# Altium schematic sheet Voltage_Measurement.SchDoc
size A4; CompanyName: Technische Hochschule Nürnberg Georg Simon Ohm; Organization: UltraZohm; Address1: Kesslerplatz 12; Address2: 90489 Nürnberg; Address3: GERMANY; DocumentNumber: 3; SheetNumber: 3; SheetTotal: 3; Website: www.ultrazohm.com
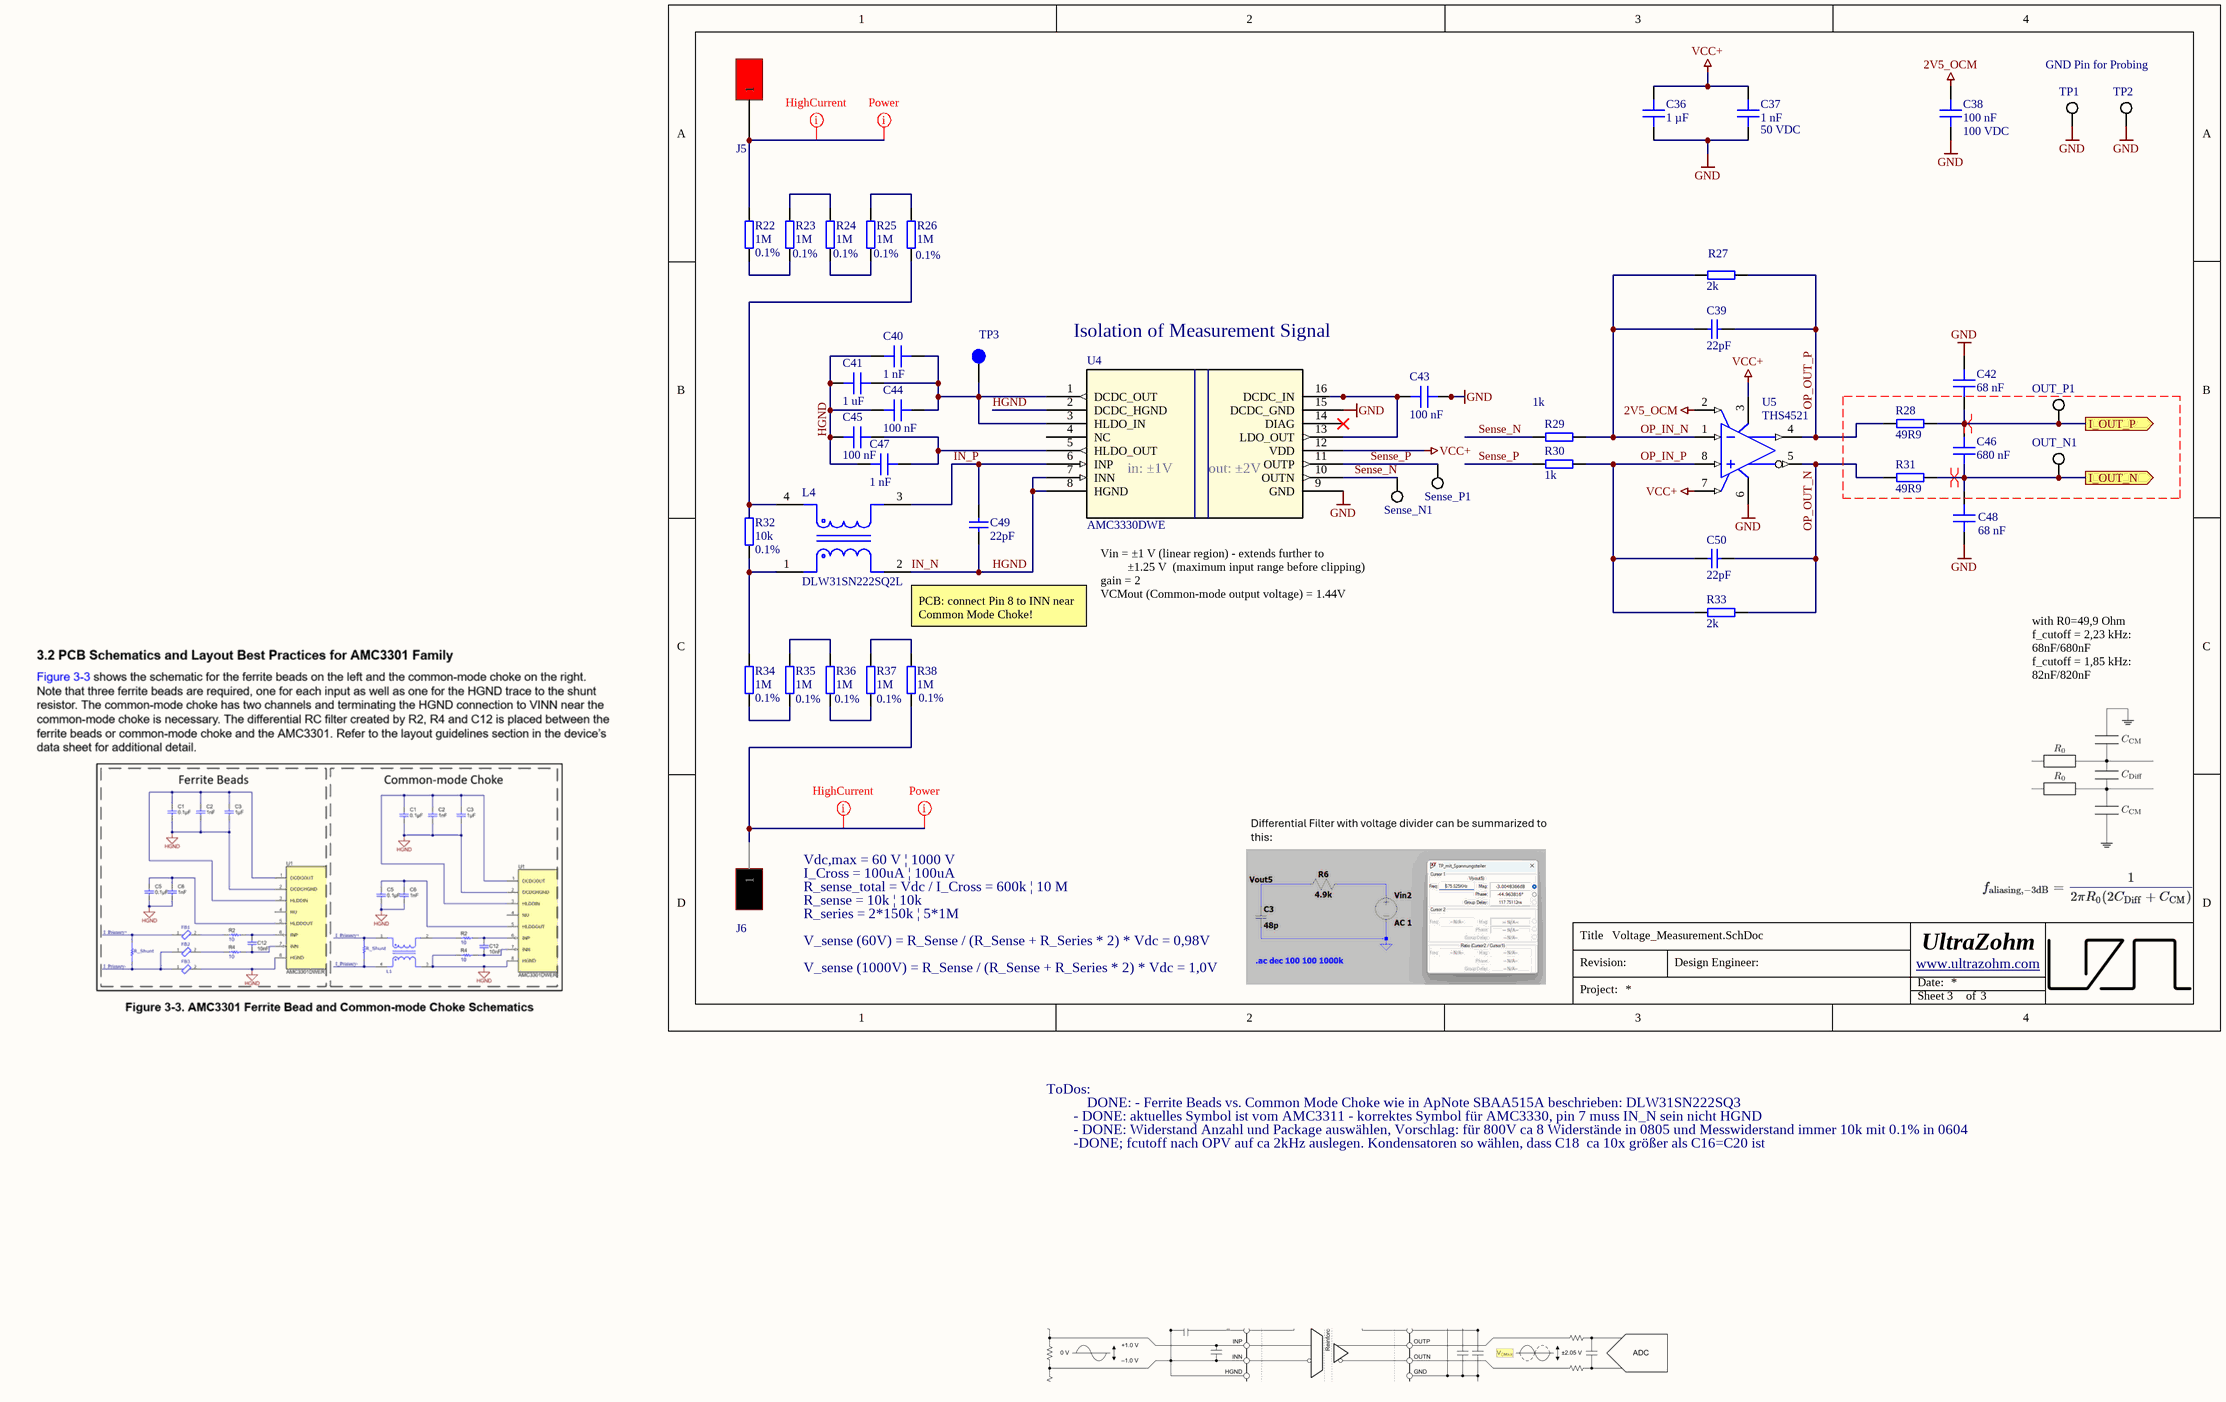
[diagram p0: Voltage_Measurement.SchDoc]

## Parts
C36  1 µF  [C_0603]
C37  1 nF  Voltage Rating: 50 VDC  [C_1206_TE]
C38  100 nF  Voltage Rating: 100 VDC  [C_0603]
C39  22pF  [C_0603_TE]
C40  1 nF  [C_0603_TE]
C41  1 uF  [C_0603]
C42  68 nF  [C_0603_TE]
C43  100 nF  [C_0603]
C44  100 nF  [C_0603]
C45  100 nF  [C_0603]
C46  680 nF  [C_0805_TE]
C47  1 nF  [C_0603_TE]
C48  68 nF  [C_0603_TE]
C49  22pF  [C_0603_TE]
C50  22pF  [C_0603_TE]
J5  FCR7350R, PCB mount 4mm jack, RED  [FCR7350]  (value not drawn)
J6  FCR7350B, PCB mount 4mm jack, BLACK  [FCR7350]  (value not drawn)
L4  DLW31SN222SQ2L  [FP-DLW31S-MFG]
OUT_N1  5015  [KSTN-5019_V]  (value not drawn)
OUT_P1  5015  [KSTN-5019_V]  (value not drawn)
R22  1M  Tolerance: 0.1%  [R_0805_TE]
R23  1M  Tolerance: 0.1%  [R_0805_TE]
R24  1M  Tolerance: 0.1%  [R_0805_TE]
R25  1M  Tolerance: 0.1%  [R_0805_TE]
R26  1M  Tolerance: 0.1%  [R_0805_TE]
R27  2k  [RES 0603_1608]
R28  49R9  [RES 0603_1608]
R29  1k  [RES 0603_1608]
R30  1k  [RES 0603_1608]
R31  49R9  [RES 0603_1608]
R32  10k  Tolerance: 0.1%  [RES 0603_1608]
R33  2k  [RES 0603_1608]
R34  1M  Tolerance: 0.1%  [R_0805_TE]
R35  1M  Tolerance: 0.1%  [R_0805_TE]
R36  1M  Tolerance: 0.1%  [R_0805_TE]
R37  1M  Tolerance: 0.1%  [R_0805_TE]
R38  1M  Tolerance: 0.1%  [R_0805_TE]
Sense_N1  5015  [KSTN-5019_V]  (value not drawn)
Sense_P1  5015  [KSTN-5019_V]  (value not drawn)
TP1  5015  [KSTN-5019_V]  (value not drawn)
TP2  5015  [KSTN-5019_V]  (value not drawn)
TP3  Testpoint 1mm  [TP_1mm]  (value not drawn)  (no BOM)
U4  AMC3330DWE  [SOIC_30DWER_TEX]
U5  THS4521  [ADA4940-1ARZ-R7]

## Ports
I_OUT_N (out), I_OUT_P (out)

## Nets
2V5_OCM: C38.1 U5.2(VOCM)
GND: C36.1 C37.1 C38.2 C42.1 C43.2 C48.2 TP1.1 TP2.1 U4.9(GND) U4.15(DCDC_GND) U5.6(VS-)
VCC+: C36.2 C37.2 U4.12(VDD) U5.3(VS+) U5.7(~{PD})
HGND: C40.1 C41.1 C44.1 C45.1 C47.1 C49.2 L4.2 U4.2(DCDC_HGND) U4.7(INN) U4.8(HGND)  [also labelled IN_N]
I_OUT_N: C46.1 C48.1 OUT_N1.1 R31.2 ; port I_OUT_N
I_OUT_P: C42.2 C46.2 OUT_P1.1 R28.2 ; port I_OUT_P
IN_P: C49.1 L4.3 U4.6(INP)
OP_IN_N: C39.2 R27.1 R29.2 U5.1(VIN-)
OP_IN_P: C50.2 R30.2 R33.1 U5.8(VIN+)
OP_OUT_N: C50.1 R31.1 R33.2 U5.5(VOUT-)
OP_OUT_P: C39.1 R27.2 R28.1 U5.4(VOUT+)
Sense_N: R29.1 Sense_N1.1 U4.10(OUTN)
Sense_P: R30.1 Sense_P1.1 U4.11(OUTP)
NetC40_2: C40.2 C41.2 C44.2 TP3.1 U4.1(DCDC_OUT) U4.3(HLDO_IN)
NetC43_1: C43.1 U4.13(LDO_OUT) U4.16(DCDC_IN)
NetC45_2: C45.2 C47.2 U4.5(HLDO_OUT)
NetJ5_1: J5.1 R22.2
NetJ6_1: J6.1 R38.1
NetL4_1: L4.1 R32.1 R34.2
NetL4_4: L4.4 R26.1 R32.2
NetR22_1: R22.1 R23.1
NetR23_2: R23.2 R24.2
NetR24_1: R24.1 R25.1
NetR25_2: R25.2 R26.2
NetR34_1: R34.1 R35.1
NetR35_2: R35.2 R36.2
NetR36_1: R36.1 R37.1
NetR37_2: R37.2 R38.2

Not connected (* = marked no-connect by the designer): U4 4(NC) 14(DIAG)*

## Layout directives
differential pair: I_OUT_N, I_OUT_P
net class Power: NetJ5_1, NetJ6_1
mark named HighCurrent: NetJ5_1, NetJ6_1

## Notes on the sheet
- GND Pin for Probing
- Isolation of Measurement Signal
- (near U4) in: ±1V
- (near U4) out: ±2V
- PCB: connect Pin 8 to INN near Common Mode Choke!
- Vin = ±1 V (linear region) - extends further to
  ±1.25 V  (maximum input range before clipping)
  gain = 2
  VCMout (Common-mode output voltage) = 1.44V
- with R0=49,9 Ohm
  f_cutoff = 2,23 kHz: 68nF/680nF
  f_cutoff = 1,85 kHz: 82nF/820nF
- Vdc,max = 60 V | 1000 V
- I_Cross = 100uA | 100uA
- R_sense_total = Vdc / I_Cross = 600k | 10 M
- R_sense = 10k | 10k
- R_series = 2*150k | 5*1M
- V_sense (60V) = R_Sense / (R_Sense + R_Series * 2) * Vdc = 0,98V
- V_sense (1000V) = R_Sense / (R_Sense + R_Series * 2) * Vdc = 1,0V
- ToDos:
- - DONE: aktuelles Symbol ist vom AMC3311 - korrektes Symbol für AMC3330, pin 7 muss IN_N sein nicht HGND
- DONE: - Ferrite Beads vs. Common Mode Choke wie in ApNote SBAA515A beschrieben: DLW31SN222SQ3
- - DONE: Widerstand Anzahl und Package auswählen, Vorschlag: für 800V ca 8 Widerstände in 0805 und Messwiderstand immer 10k mit 0.1% in 0604
- -DONE; fcutoff nach OPV auf ca 2kHz auslegen. Kondensatoren so wählen, dass C18  ca 10x größer als C16=C20 ist
- Title
- Revision:
- Design Engineer:
- Date:
- Project:
- Sheet
- of

## Library data of the parts
C36 = CL10A105KB8NNNC: 50V 1uF X5R ±10% 0603  Multilayer Ceramic Capacitors MLCC - SMD/SMT ROHS; Manufacturer: Samsung Electro-Mechanics; Voltage Rating: 50 VDC; Created from: MGremer; Manufacturer Part Number: CL10A105KB8NNNC; PartID: 5; Created On: 20.12.2020 13:54:13; ComponentLink1Description: Datasheet; ComponentLink1URL: https://datasheet.lcsc.com/lcsc/1810261812_Samsung-Electro-Mechanics-CL10A105KB8NNNC_C15849.pdf; Component Type: Capacitor 0603; Device Package: 0603; Last Updated: 28.11.2022 17:23:01; Mounting Type: SMD; Operating Temperature: -55 - 85°C; Series: M; Supplier 1: LCSC; Supplier Part Number 1: C15849; Type: Capacitor; Tolerance: 10 %; Value: 1 µF; Live Cycle Status: 1; Stock number: Labor SMD Container; LCSC Part Number: C15849
C37 = CC1206KRX7R9BB102: 1nF 50V X7R ±10% 1206 Multilayer Ceramic Capacitors MLCC - SMD/SMT ROHS; Manufacturer: YAGEO; Created from: NDiringer; Manufacturer Part Number: CC1206KRX7R9BB102; PartID: 505; Created On: 25.08.2025 08:45:14; ComponentLink1Description: Datasheet; ComponentLink1URL: https://jlcpcb.com/partdetail/YAGEO-CC1206KRX7R9BB102/C107207; Component Type: Capacitor 1206; Device Package: 1206; Last Updated: 25.08.2025 08:45:14; Mounting Type: SMD; Operating Temperature: -55 to +125°C; Series: X7R; Supplier 1: JLCPCB; Supplier Part Number 1: C107207; Type: Capacitor; Tolerance: 10 %; Value: 1 nF; Live Cycle Status: 1; Stock number: not stored; Supplier 2: LCSC; Supplier Part Number 2: C107207; LCSC Part Number: C107207
C38 = C1608X7S2A104KT000N: 100V 100nF X7S ±10% 0603 Multilayer Ceramic Capacitors MLCC - SMD/SMT ROHS; Manufacturer: TDK; Created from: AGeiger; Manufacturer Part Number: C1608X7S2A104KT000N; PartID: 148; Created On: 20.12.2020 13:54:13; ComponentLink1Description: Datasheet; ComponentLink1URL: https://datasheet.lcsc.com/lcsc/2304140030_TDK-C1608X7S2A104KT000N_C343025.pdf; Component Type: Capacitor 0603; Device Package: 0603; Last Updated: 14.12.2022 12:14:21; Mounting Type: SMD; Operating Temperature: -55 to 125°C; Series: X7R; Supplier 1: LCSC; Supplier Part Number 1: C343025; Type: Capacitor; Tolerance: 10 %; Value: 100 nF; Live Cycle Status: 1; LCSC Part Number: C343025; Stock number: not stored
C39 C49 C50 = CL10C220JB8NNNC: 50V 22pF C0G ±5% 0603 Multilayer Ceramic Capacitors MLCC - SMD/SMT ROHS; Manufacturer: Samsung Electro-Mechanics; Created from: Kilhan; Manufacturer Part Number: CL10C220JB8NNNC; ComponentLink1Description: Datasheet; ComponentLink1URL: https://jlcpcb.com/api/file/downloadByFileSystemAccessId/8579707043277824000; Series: C0G; Supplier 1: LCSC; Supplier Part Number 1: C1653; Tolerance: 5%; Voltage Rating: 50V; PartID: 172; Created On: 22.06.2025 13:02:55; Component Type: Capacitor 0603; Device Package: 0603; Last Updated: 22.06.2025 13:02:55; Mounting Type: SMD; Operating Temperature: –55 to 125°C; Type: Capacitor; Value: 22pF; Live Cycle Status: 1; Stock number: not stored; LCSC Part Number: C1653
C40 C47 = CC0603KRX7R9BB102: 1nF 50V X7R ±10% 0603 Multilayer Ceramic Capacitors MLCC - SMD/SMT ROHS; Manufacturer: YAGEO; Created from: NDiringer; Voltage Rating: 50 VDC; Manufacturer Part Number: CC0603KRX7R9BB102; PartID: 507; Created On: 25.08.2025 09:10:16; Value: 1 nF; Device Package: 0603; Tolerance: 10 %; Mounting Type: SMD; Last Updated: 25.08.2025 09:34:56; ComponentLink1Description: Datasheet; ComponentLink1URL: https://jlcpcb.com/partdetail/YAGEO-CC0603KRX7R9BB102/C100040; Component Type: Capacitor 0603; Operating Temperature: -55 to +125°C; Series: X7R; Supplier 1: JLCPCB; Supplier Part Number 1: C100040; Supplier 2: LCSC; Supplier Part Number 2: C100040; Type: Capacitor; Live Cycle Status: 1; LCSC Part Number: C100040; Stock number: not stored
C41 = CC0603KRX5R9BB105: 1uF 50V X5R ±10% 0603 Multilayer Ceramic Capacitors MLCC - SMD/SMT ROHS; Manufacturer: YAGEO; Voltage Rating: 50 VDC; Created from: NDiringer; Manufacturer Part Number: CC0603KRX5R9BB105; PartID: 508; Created On: 25.08.2025 09:26:51; ComponentLink1Description: Datasheet; ComponentLink1URL: https://jlcpcb.com/partdetail/YAGEO-CC0603KRX5R9BB105/C128624; Component Type: Capacitor 0603; Device Package: 0603; Last Updated: 25.08.2025 09:28:02; Mounting Type: SMD; Operating Temperature: -55 to +125°C; Series: X7R; Supplier 1: JLCPCB; Supplier Part Number 1: C128624; Supplier 2: LCSC; Supplier Part Number 2: C15849; Type: Capacitor; Tolerance: 10 %; Value: 1 uF; Live Cycle Status: 1; LCSC Part Number: C15849; Stock number: not stored
C42 C48 = CC0603JRX7R9BB683: 50V 68nF X7R ±5% 0603 Multilayer Ceramic Capacitors MLCC - SMD/SMT ROHS; Manufacturer: YAGEO; Voltage Rating: 50 VDC; Created from: NDiringer; Manufacturer Part Number: CC0603JRX7R9BB683; ComponentLink1Description: Datasheet; ComponentLink1URL: https://jlcpcb.com/partdetail/YAGEO-CC0603JRX7R9BB683/C309475; Series: X7R; Supplier 1: JLCPCB; Supplier Part Number 1: C309475; Tolerance: 5 %; PartID: 503; Created On: 14.08.2025 15:37:55; Component Type: Capacitor 0603; Last Updated: 25.08.2025 09:35:07; Mounting Type: SMD; Operating Temperature: -55 to +125°C; Type: Capacitor; Value: 68 nF; Live Cycle Status: 1; Stock number: not stored; LCSC Part Number: C309475; Device Package: 0603
C43-C45 = CC0603KRX7R9BB104: Capacitor 0603, 50 VDC, 100 nF, X7R; Manufacturer: YAGEO; Tolerance: 10 %; Created from: AGeiger; Voltage Rating: 50 VDC; Manufacturer Part Number: CC0603KRX7R9BB104; PartID: 102; Created On: 22.08.2022 14:35:53; Value: 100 nF; Device Package: 0603; Mounting Type: SMD; Last Updated: 22.08.2022 14:35:53; ComponentLink1Description: Datasheet; ComponentLink1URL: https://datasheet.lcsc.com/lcsc/1809301912_YAGEO-CC0603KRX7R9BB104_C14663.pdf; Component Type: Capacitor 0603; Operating Temperature: -55 - 125°C; Series: X7R; Supplier 1: LCSC; Supplier Part Number 1: C14663; Type: Capacitor; Live Cycle Status: 1; LCSC Part Number: C14663; Supplier 2: Mouser; Supplier Part Number 2: 603-CC603KRX7R9BB104
C46 = CC0805KKX7R9BB684: 50V 680nF X7R ±10% 0805 Multilayer Ceramic Capacitors MLCC - SMD/SMT ROHS; Manufacturer: YAGEO; Voltage Rating: 50 VDC; Created from: NDiringer; Manufacturer Part Number: CC0805KKX7R9BB684; ComponentLink1Description: Datasheet; ComponentLink1URL: https://jlcpcb.com/partdetail/YAGEO-CC0805KKX7R9BB684/C107133; Series: X7R; Supplier 1: JLCPCB; Supplier Part Number 1: C107133; Tolerance: 10 %; PartID: 504; Created On: 14.08.2025 15:43:13; Component Type: Capacitor 0805; Device Package: 0805; Last Updated: 14.08.2025 15:43:13; Mounting Type: SMD; Operating Temperature: -55 to +125°C; Type: Capacitor; Value: 680 nF; Live Cycle Status: 1; Stock number: not stored; LCSC Part Number: C107133
J5 = FCR7350R: FCR7350B, 1000V, 24A, RED; Manufacturer: Cliff; Value: PCB mount 4mm jack, Red FCR7350R, 1000V, 24A; Created from: DHufnagel; Manufacturer Part Number: FCR7350R; PartID: 7; Created On: 13.06.2022 10:18:11; ComponentLink1Description: datasheet; ComponentLink1URL: https://www.cliffuk.co.uk/products/testleads/sockets/S16NPC.pdf; ComponentLink2Description: drawing; ComponentLink2URL: https://media.digikey.com/pdf/Data%20Sheets/Cliff%20Electronic%20LTD%20PDF's/FCR7350_Drawing.pdf; Component Type: PCB mount 4mm jack, Red; Device Package: THT; Last Updated: 21.02.2024 15:19:13; Minimum Order: 1; Mounting Type: THT; Operating Temperature: -40°C - 80°C; Series: S16N-PC; Supplier 1: Digi-Key; Supplier Part Number 1: 3185-FCR7350R-ND; Supplier 2: farnell; Supplier Part Number 2: 1854508; Type: PCB mount 4mm jack, Red FCR7350R, 1000V, 24A; Live Cycle Status: 1; Stock number: not stored; Supplier 3: LCSC; Supplier Part Number 3: C7437326; LCSC Part Number: C7437326
J6 = FCR7350B: FCR7350B, 1000V, 24A, BLACK; Manufacturer: Cliff; Value: PCB mount 4mm jack, Black	FCR7350B, 1000V, 24A; Created from: DHufnagel; Manufacturer Part Number: FCR7350B; PartID: 6; Created On: 13.06.2022 10:18:11; ComponentLink1Description: datasheet; ComponentLink1URL: https://www.cliffuk.co.uk/products/testleads/sockets/S16NPC.pdf; ComponentLink2Description: drawing; ComponentLink2URL: https://media.digikey.com/pdf/Data%20Sheets/Cliff%20Electronic%20LTD%20PDF's/FCR7350_Drawing.pdf; Component Type: PCB mount 4mm jack, Black; Device Package: THT; Last Updated: 21.02.2024 15:21:29; Minimum Order: 1; Mounting Type: THT; Operating Temperature: -40°C - 80°C; Series: S16N-PC; Supplier 1: Digi-Key; Supplier Part Number 1: 3185-FCR7350B-ND; Supplier 2: farnell; Supplier Part Number 2: 1854507; Type: PCB mount 4mm jack, Black	FCR7350B, 1000V, 24A; Live Cycle Status: 1; Stock number: not stored; Supplier 3: LCSC; Supplier Part Number 3: C7437327; LCSC Part Number: C7437327
L4 = CMP-06045-000034-1: CMC 200MA 2LN 2.2 KOHM SMD; Number of Lines: 2; Voltage Rating: 50V; Voltage Rating (DC): 125V; DC Resistance (DCR): 1.2R; Impedance: 2.2kR; Shielding: Unshielded; Tolerance: 25%; Insulation Resistance: 10MR; Test Frequency: 100MHz; Depth: 1.8mm; DC Current: 200mA; Case/Package: 1206; Number of Pins: 4; Current Rating: 200mA; Weight: 0.001376oz; Current: 200mA; Packaging: Tape and Reel; Termination: SMD/SMT; Height: 1.9mm; Length: 3.2mm; Military Standard: Not; Package Quantity: 1; Mount: Surface Mount; Max Operating Temperature: 85°C; Max DC Current: 200mA; Radiation Hardening: No; Resistor Type: Wirewound; Lead Free: Lead Free; Case Code (Imperial): 1206; Width: 0.063inch; Min Operating Temperature: -40°C; Self Resonant Frequency: 100MHz; REACH SVHC: No SVHC
OUT_N1 OUT_P1 Sense_N1 Sense_P1 TP1 TP2 = 5015: Circuit Board Hardware - PCB SM TEST POINT ON T&R - MINIATURE; Manufacturer: Keystone Electronics; Value: SMD Testpoint; Created from: AGeiger; Supplier Part Number 1: 534-5015; LCSC Part Number: C5199798; Manufacturer Part Number: 5015; PartID: 26; Created On: 03.06.2023 11:19:55; ComponentLink1Description: Datasheet; ComponentLink1URL: https://www.mouser.de/datasheet/2/215/015-744075.pdf; Component Type: Circuit Board Hardware; Device Package: SMD; Last Updated: 03.06.2023 11:43:17; Mounting Type: SMD; Supplier 1: Mouser; Type: PCB SMD Testpoint; Live Cycle Status: 1; ComponentLink2URL: http://www.keyelco.com/product-pdf.cfm?p=1357; ComponentLink2Description: Datasheet
R22-R26 R34-R38 = RT0805BRD071ML: -55℃~+155℃ 125mW 150V 1MΩ Thin Film Resistor ±0.1% ±25ppm/℃ 0805 Chip Resistor - Surface Mount ROHS; Manufacturer: YAGEO; Created from: NDiringer; Manufacturer Part Number: RT0805BRD071ML; PartID: 377; Created On: 26.08.2025 13:45:09; ComponentLink1Description: Datasheet; ComponentLink1URL: https://jlcpcb.com/partdetail/YAGEO-RT0805BRD071ML/C706228; Component Type: SMD resistor; Device Package: 0805; Last Updated: 26.08.2025 13:57:14; Mounting Type: SMD; Supplier 1: LCSC; Supplier Part Number 1: C706228; Supplier 2: JLCPCB; Supplier Part Number 2: C706228; Type: Resistor; Value: 1M; Live Cycle Status: 1; Stock number: not stored; LCSC Part Number: C706228
R27 R33 = ERJ-PB3B2001V: SMD resistor 0.1%; Manufacturer: Panasonic; Created from: DHufnagel; Manufacturer Part Number: ERJ-PB3B2001V; PartID: 215; Created On: 14.12.2020 16:17:14; ComponentLink1Description: Datasheet; ComponentLink1URL: https://www.mouser.de/datasheet/2/315/AOA0000C328-1530132.pdf; Component Type: SMD resistor; Device Package: 0603; Last Updated: 02.03.2021 14:07:32; Mounting Type: SMD; Supplier 1: Mouser; Supplier Part Number 1: 667-ERJ-PB3B2001V; Type: Resistor; Value: 2k; Live Cycle Status: 1; Stock number: not stored; LCSC Part Number: C728588; Tolerance: 0.1%; Supplier 2: LCSC; Supplier Part Number 2: C728588
R28 R31 = RC0603FR-0749R9L: 100mW Thick Film Resistors ±100ppm/℃ ±1% 49.9Ω 0603 Chip Resistor - Surface Mount ROHS; Manufacturer: YAGEO; Created from: AGeiger; Manufacturer Part Number: RC0603FR-0749R9L; PartID: 277; Created On: 14.06.2023 17:42:26; ComponentLink1Description: Datasheet; ComponentLink1URL: https://datasheet.lcsc.com/lcsc/2304140030_YAGEO-RC0603FR-0749R9L_C114625.pdf; Component Type: SMD resistor; Device Package: 0603; Last Updated: 14.06.2023 17:42:26; Mounting Type: SMD; Supplier 1: LCSC; Supplier Part Number 1: C114625; Type: Resistor; Tolerance: 1%; Value: 49R9; Live Cycle Status: 1; LCSC Part Number: C114625
R29 R30 = AR03BTCX1001: 100mW ±0.1% ±25ppm/℃ 1kΩ 0603 Chip Resistor - Surface Mount ROHS; Manufacturer: Viking Tech; Created from: AGeiger; Manufacturer Part Number: AR03BTCX1001; PartID: 240; Created On: 03.09.2022 10:12:43; ComponentLink1Description: Datasheet; ComponentLink1URL: https://datasheet.lcsc.com/lcsc/2011191435_Viking-Tech-AR03BTCX1001_C304069.pdf; Component Type: SMD resistor; Device Package: 0603; Last Updated: 03.09.2022 10:12:43; Mounting Type: SMD; Supplier 1: LCSC; Supplier Part Number 1: C304069; Type: Resistor; Value: 1k; Live Cycle Status: 1; LCSC Part Number: C304069; Tolerance: 0.1%
R32 = RQ73C1J10KBTD: SMD resistor 0.1%, 10ppm; Manufacturer: TE Connectivity; Created from: DHufnagel; Manufacturer Part Number: RQ73C1J10KBTD; PartID: 231; Created On: 14.12.2020 16:17:14; ComponentLink1Description: Datasheet; ComponentLink1URL: https://www.mouser.de/datasheet/2/418/5/ENG_DS_1773270_2_B-1533717.pdf; Component Type: SMD resistor; Device Package: 0603; Last Updated: 21.02.2024 15:51:17; Mounting Type: SMD; Supplier 1: Mouser; Supplier Part Number 1: 279-RQ73C1J10KBTD; Supplier 2: LCSC; Supplier Part Number 2: C95204; Type: Resistor; Value: 10k; Live Cycle Status: 1; Stock number: not stored; LCSC Part Number: C95204
TP3 = NULL: Manufacturer Part Number: NULL; Created from: AGeiger; Created: 2018_06_25_AGeiger; Value: Testpoint 1mm; PartID: 9; Created On: 20.09.2022 13:14:57; Component Type: Testpoint; Last Updated: 20.09.2022 13:15:39; Manufacturer: NULL; Supplier 1: NULL; Supplier Part Number 1: NULL; Type: Testpoint; Live Cycle Status: 1
U4 = AMC3330DWE: ±1-V input, precision voltage sensing reinforced isolated amplifier with integrated DC/DC; Manufacturer: Texas Instruments; Channels: 1; Created from: NDiringer; Manufacturer Part Number: AMC3330DWE; PartID: 41; Created On: 20.08.2025 13:08:03; ComponentLink1Description: Datasheet; ComponentLink1URL: https://www.ti.com/product/AMC3330; Component Type: Differential Amplifier; Device Package: SOIC-16; Last Updated: 20.08.2025 13:08:03; Mounting Type: SMD; Operating Temperature: -40 to +125 °C; Series: AMC3330; Supplier 1: LCSC; Supplier Part Number 1: C2999368; Type: Differential Amplifiers; Live Cycle Status: 1; LCSC Part Number: C2999368; Stock number: not stored
U5 = THS4521IDGKR: 145MHz 240uV 700nA Single Channel 95MHz SOIC-8 Differential Amplifiers ROHS; Manufacturer: Texas Instruments; Manufacturer Part Number: THS4521IDR; Min Dual Supply Voltage: 1.5V; Max Dual Supply Voltage: 2.75V; Number of Channels: 1; Voltage Gain: 119dB; Slew Rate: 490V/µs; Max I/O Voltage: 2mV; Max Supply Voltage: 5.5V; Min Supply Voltage: 2.5V; Common Mode Rejection Ratio: 80dB; Operating Supply Voltage: 5V; Nominal Supply Current: 1.14mA; Input Bias Current: 900nA; Output Current per Channel: 55mA; Supplier 1: Mouser; RoHS: Yes; Category: Amplifiers - Op Amps, Buffer, Instrumentation; Stock 1: 12114; Pricing 1: 1=2,55000, 10=2,29000, 25=2,16000, 100=1,78000, 250=1,59000, 500=1,54000, 1000=1,28000, 2500=1,25000, 1=2,83000, 10=2,54000, 25=2,40000, 100=1,98000, 250=1,77000, 500=1,71000 (EUR); Case/Package: SOIC8; Number of Pins: 8; Weight: 0.000935oz; Min Operating Temperature: -40°C; Max Operating Temperature: 85°C; Packaging: Tape and Reel; Unity Gain Bandwidth Product: 95MHz; Bandwidth: 145MHz; Package Quantity: 2500; -3db Bandwidth: 145MHz; Gain Bandwidth Product: 95MHz; Input Offset Voltage (Vos): 2mV; Operating Supply Current: 1.14mA; Power Supply Rejection Ratio (PSRR): 80dB; Number of Circuits: 1; Number of Elements: 1; Number of Amplifiers: 1; Radiation Hardening: No; Lead Free: Lead Free; REACH SVHC: No SVHC; ComponentLink1URL: https://datasheet.ciiva.com/14456/sbos458f-14456592.pdf?src-supplier=Avnet; ComponentLink1Description: old Datasheet; ComponentLink2URL: https://datasheet.ciiva.com/18622/ths4521-18622155.pdf?src-supplier=Digi-Key; ComponentLink2Description: Datasheet; Supplier Part Number 1: 595-THS4521IDR; ComponentLink3Description: Manufacturer; ComponentLink3URL: https://www.ti.com/; LCSC Part Number: C16092